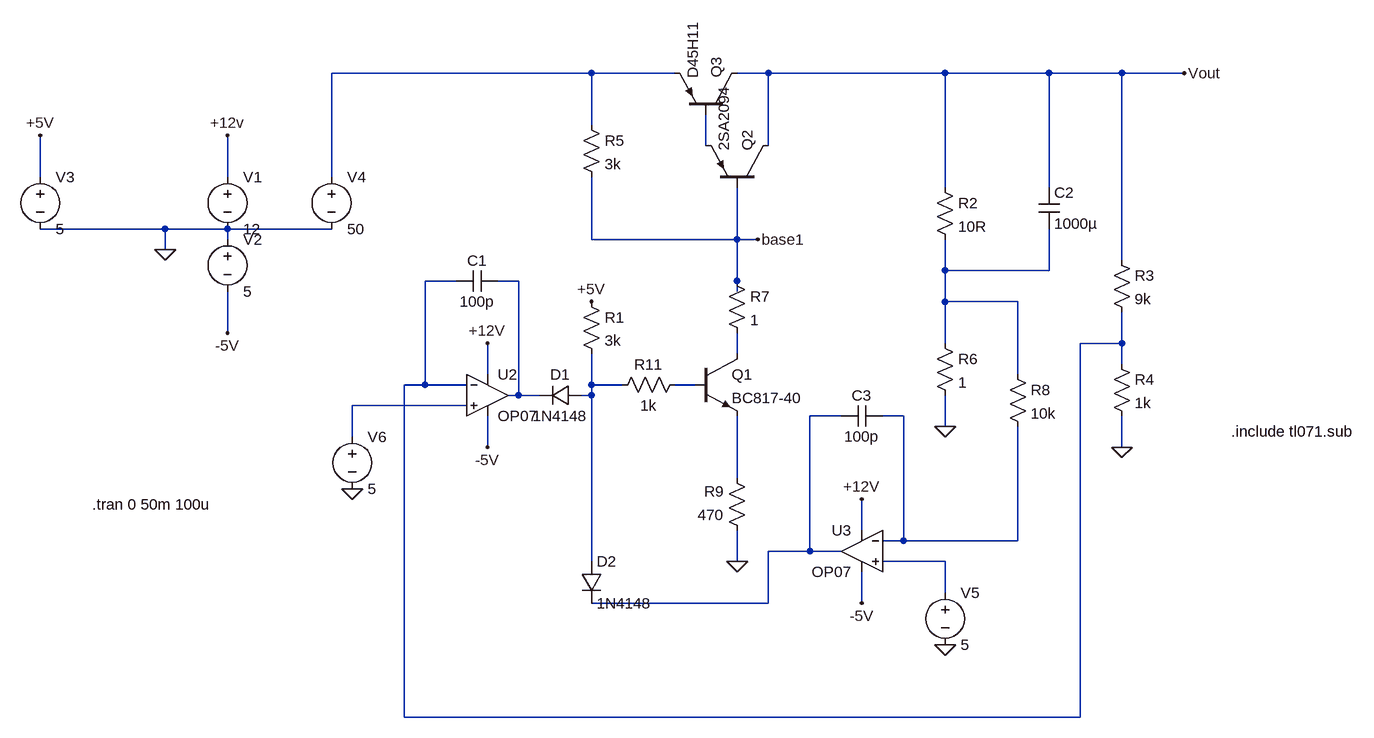
[diagram p0: schematic analog_power_supply_op07.asc]
analog_power_supply_op07.asc, the LTspice schematic file:
Version 4
SHEET 1 1640 696
WIRE 448 -304 48 -304
WIRE 576 -304 448 -304
WIRE 720 -304 672 -304
WIRE 992 -304 720 -304
WIRE 1152 -304 992 -304
WIRE 1264 -304 1152 -304
WIRE 1360 -304 1264 -304
WIRE 448 -224 448 -304
WIRE 624 -192 624 -240
WIRE 720 -192 720 -304
WIRE -400 -144 -400 -208
WIRE -112 -144 -112 -208
WIRE 48 -144 48 -304
WIRE 992 -128 992 -304
WIRE 1152 -128 1152 -304
WIRE -208 -64 -400 -64
WIRE -112 -64 -208 -64
WIRE 48 -64 -112 -64
WIRE -112 -48 -112 -64
WIRE 448 -48 448 -144
WIRE 672 -48 672 -128
WIRE 672 -48 448 -48
WIRE 704 -48 672 -48
WIRE -208 -32 -208 -64
WIRE 1264 -16 1264 -304
WIRE 992 0 992 -48
WIRE 1152 0 1152 -64
WIRE 1152 0 992 0
WIRE 240 16 192 16
WIRE 336 16 304 16
WIRE 672 16 672 -48
WIRE 672 32 672 16
WIRE 992 48 992 0
WIRE 1104 48 992 48
WIRE -112 96 -112 32
WIRE 992 112 992 48
WIRE 1264 112 1264 64
WIRE 1264 112 1200 112
WIRE 672 128 672 96
WIRE 1264 144 1264 112
WIRE 288 160 288 112
WIRE 1104 160 1104 48
WIRE 192 176 192 16
WIRE 192 176 160 176
WIRE 256 176 192 176
WIRE 448 176 448 128
WIRE 496 176 448 176
WIRE 608 176 576 176
WIRE 336 192 336 16
WIRE 336 192 320 192
WIRE 368 192 336 192
WIRE 448 192 448 176
WIRE 448 192 432 192
WIRE 256 208 80 208
WIRE 832 224 784 224
WIRE 928 224 896 224
WIRE 992 240 992 192
WIRE 80 256 80 208
WIRE 288 272 288 224
WIRE 1264 272 1264 224
WIRE 672 320 672 224
WIRE 864 400 864 352
WIRE 928 416 928 224
WIRE 928 416 896 416
WIRE 1104 416 1104 240
WIRE 1104 416 928 416
WIRE 784 432 784 224
WIRE 784 432 720 432
WIRE 832 432 784 432
WIRE 448 448 448 192
WIRE 672 448 672 400
WIRE 992 448 896 448
WIRE 992 496 992 448
WIRE 720 512 720 432
WIRE 720 512 448 512
WIRE 864 512 864 464
WIRE 160 688 160 176
WIRE 1200 688 1200 112
WIRE 1200 688 160 688
FLAG -208 -32 0
FLAG -112 96 -5V
FLAG -112 -208 +12v
FLAG 288 112 +12V
FLAG 288 272 -5V
FLAG -400 -208 +5V
FLAG 672 448 0
FLAG 992 240 0
FLAG 1264 272 0
FLAG 1360 -304 Vout
FLAG 704 -48 base1
FLAG 864 352 +12V
FLAG 864 512 -5V
FLAG 992 576 0
FLAG 448 48 +5V
FLAG 80 336 0
SYMBOL voltage -112 -160 R0
WINDOW 123 0 0 Left 0
WINDOW 39 0 0 Left 0
SYMATTR InstName V1
SYMATTR Value 12
SYMBOL voltage -112 -64 R0
WINDOW 123 0 0 Left 0
WINDOW 39 0 0 Left 0
SYMATTR InstName V2
SYMATTR Value 5
SYMBOL voltage -400 -160 R0
WINDOW 123 0 0 Left 0
WINDOW 39 0 0 Left 0
SYMATTR InstName V3
SYMATTR Value 5
SYMBOL npn 608 128 R0
SYMATTR InstName Q1
SYMATTR Value BC817-40
SYMBOL res 976 -144 R0
SYMATTR InstName R2
SYMATTR Value 10R
SYMBOL res 1248 -32 R0
SYMATTR InstName R3
SYMATTR Value 9k
SYMBOL res 1248 128 R0
SYMATTR InstName R4
SYMATTR Value 1k
SYMBOL voltage 48 -160 R0
WINDOW 123 0 0 Left 0
WINDOW 39 0 0 Left 0
SYMATTR InstName V4
SYMATTR Value 50
SYMBOL res 432 -240 R0
SYMATTR InstName R5
SYMATTR Value 3k
SYMBOL res 656 0 R0
SYMATTR InstName R7
SYMATTR Value 1
SYMBOL cap 304 0 R90
WINDOW 0 0 32 VBottom 2
WINDOW 3 32 32 VTop 2
SYMATTR InstName C1
SYMATTR Value 100p
SYMBOL res 688 416 R180
WINDOW 0 36 76 Left 2
WINDOW 3 36 40 Left 2
SYMATTR InstName R9
SYMATTR Value 470
SYMBOL pnp 720 -128 M270
SYMATTR InstName Q2
SYMATTR Value 2SA2094
SYMBOL pnp 672 -240 M270
SYMATTR InstName Q3
SYMATTR Value D45H11
SYMBOL cap 1136 -128 R0
SYMATTR InstName C2
SYMATTR Value 1000µ
SYMBOL res 976 96 R0
SYMATTR InstName R6
SYMATTR Value 1
SYMBOL res 1088 144 R0
SYMATTR InstName R8
SYMATTR Value 10k
SYMBOL cap 896 208 R90
WINDOW 0 0 32 VBottom 2
WINDOW 3 32 32 VTop 2
SYMATTR InstName C3
SYMATTR Value 100p
SYMBOL voltage 992 480 R0
WINDOW 123 0 0 Left 0
WINDOW 39 0 0 Left 0
SYMATTR InstName V5
SYMATTR Value 5
SYMBOL OpAmps\\OP07 288 128 R0
SYMATTR InstName U2
SYMBOL OpAmps\\OP07 864 368 M0
SYMATTR InstName U3
SYMBOL diode 432 176 R90
WINDOW 0 0 32 VBottom 2
WINDOW 3 32 32 VTop 2
SYMATTR InstName D1
SYMATTR Value 1N4148
SYMBOL diode 432 448 R0
SYMATTR InstName D2
SYMATTR Value 1N4148
SYMBOL res 432 32 R0
SYMATTR InstName R1
SYMATTR Value 3k
SYMBOL res 592 160 R90
WINDOW 0 0 56 VBottom 2
WINDOW 3 32 56 VTop 2
SYMATTR InstName R11
SYMATTR Value 1k
SYMBOL voltage 80 240 R0
WINDOW 123 0 0 Left 0
WINDOW 39 0 0 Left 0
SYMATTR InstName V6
SYMATTR Value 5
TEXT -320 360 Left 2 !.tran 0 50m 100u
TEXT 1432 248 Left 2 !.include tl071.sub

The netlist it stands for:
* analog_power_supply_op07.asc
V1 +12v 0 12
V2 0 -5V 5
V3 +5V 0 5
Q1 N006 N008 N012 0 BC817-40
R2 Vout N003 10R
R3 Vout N004 9k
R4 N004 0 1k
V4 N001 0 50
R5 N001 base1 3k
R7 base1 N006 1
C1 N005 N004 100p
R9 0 N012 470
Q2 Vout base1 N002 0 2SA2094
Q3 Vout N002 N001 0 D45H11
C2 Vout N003 1000µ
R6 N003 0 1
R8 N003 N011 10k
C3 N011 N010 100p
V5 N013 0 5
XU2 N009 N004 +12v -5V N005 LT1001  ; OP07, pins In+ In- V+ V- OUT
XU3 N013 N011 +12v -5V N010 LT1001  ; OP07, pins In+ In- V+ V- OUT
D1 N007 N005 1N4148
D2 N007 N010 1N4148
R1 +5V N007 3k
R11 N008 N007 1k
V6 N009 0 5
.model D D
.lib standard.dio
.model NPN NPN
.model PNP PNP
.lib standard.bjt
.tran 0 50m 100u
.include tl071.sub
.lib LTC.lib
.backanno
.end